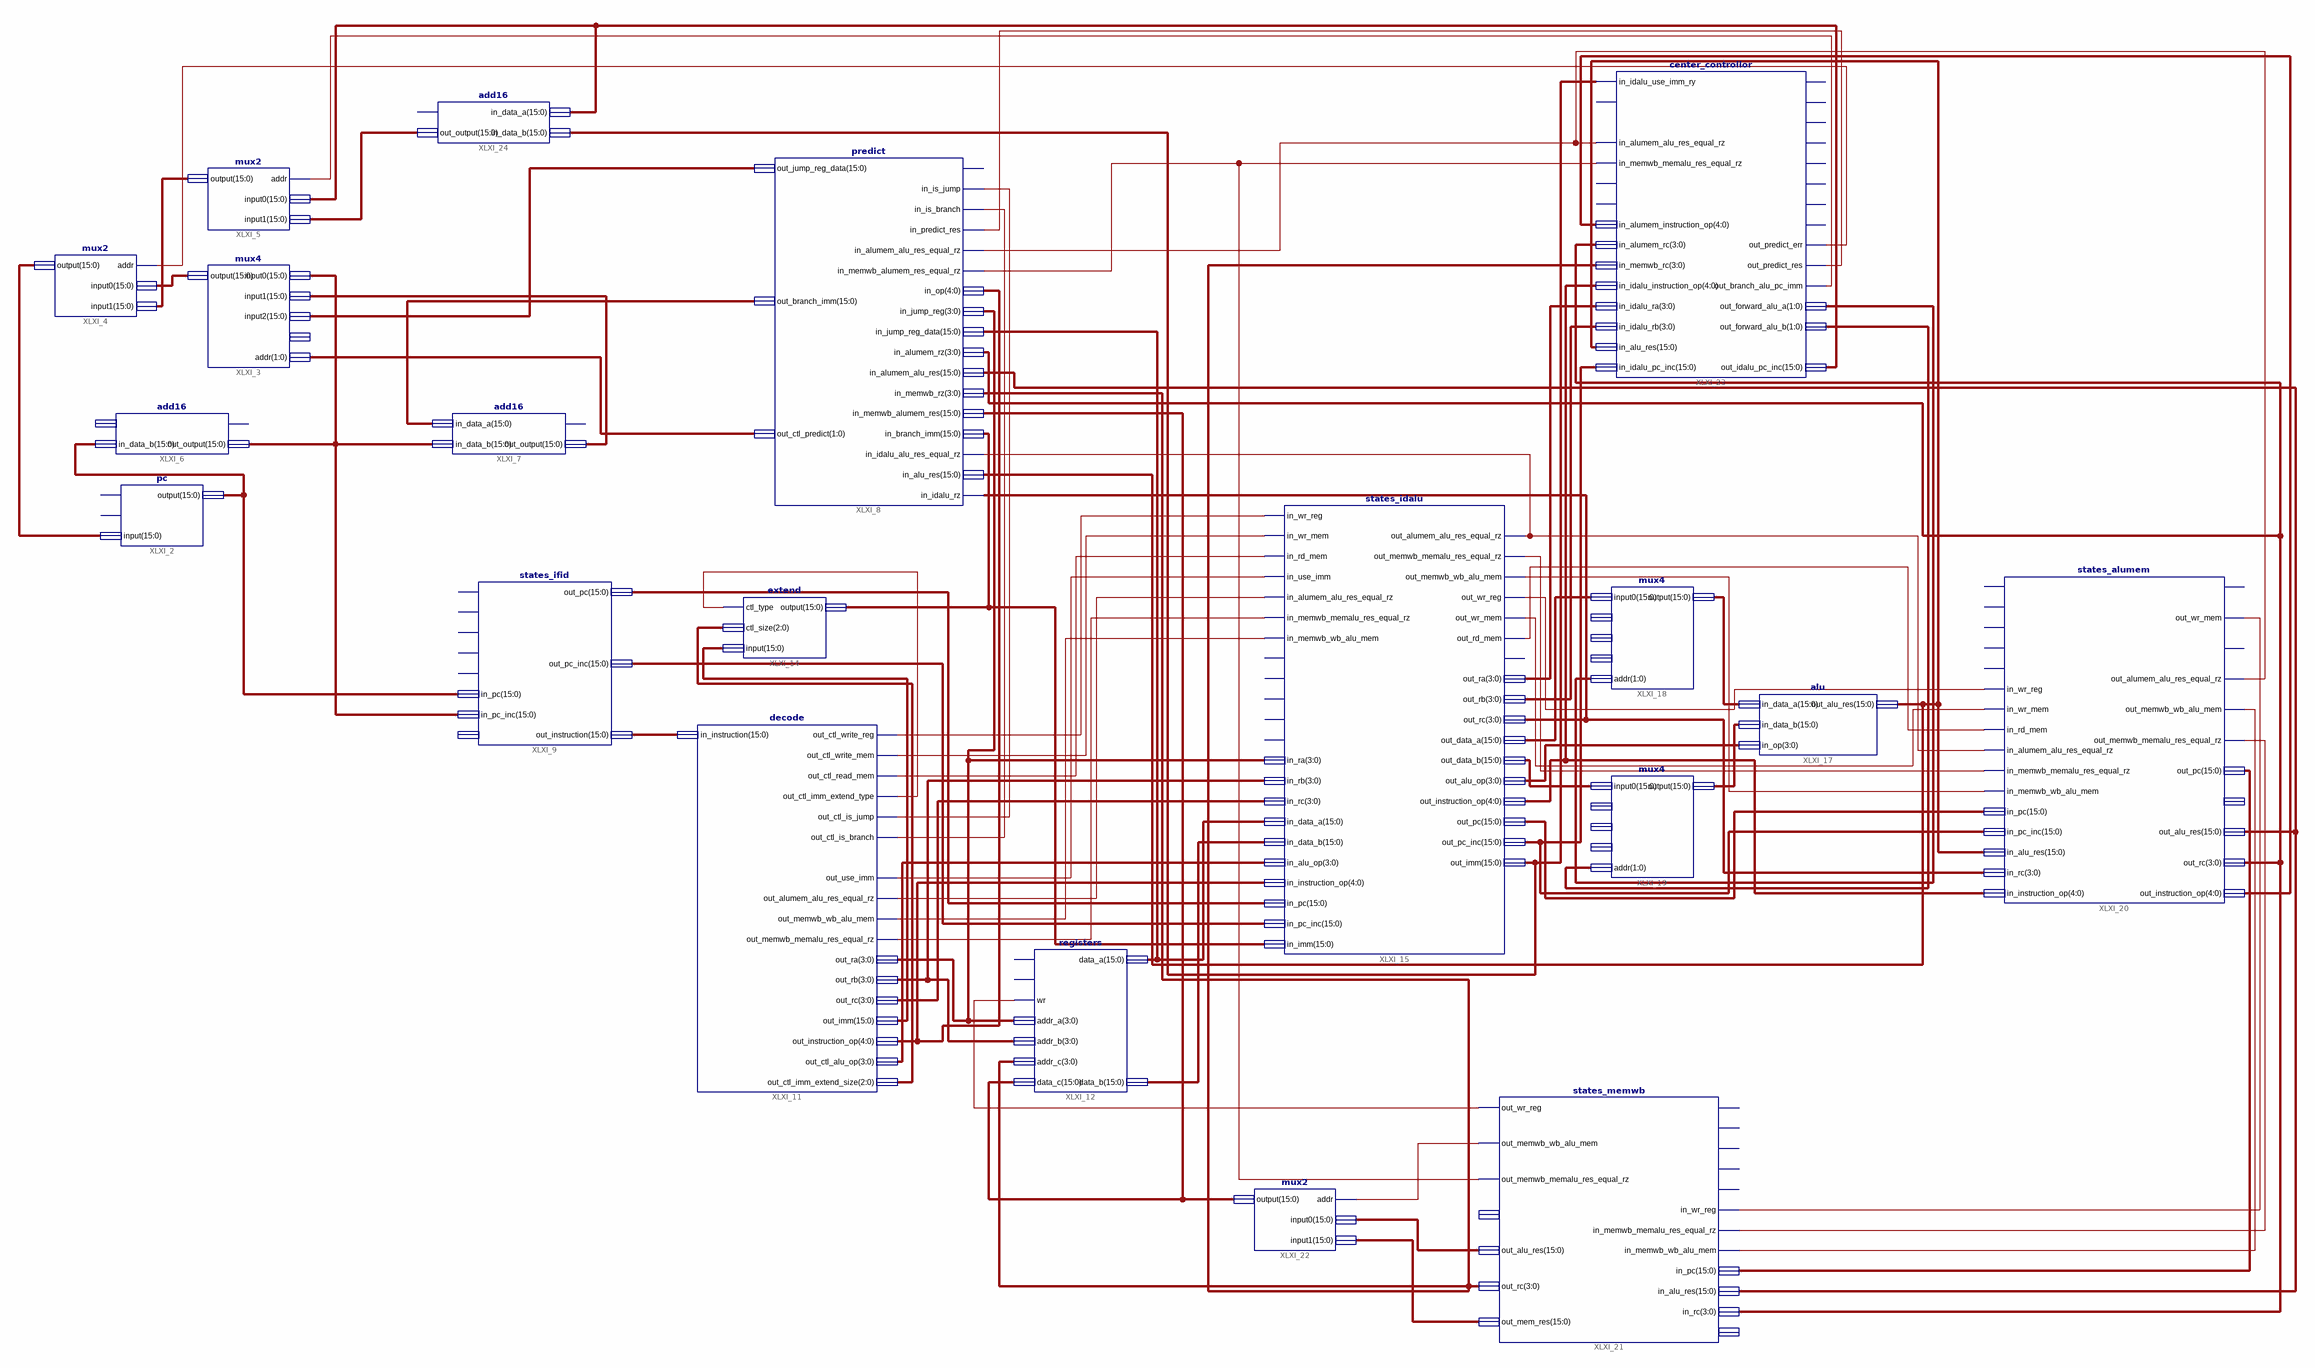
[diagram p0: schematic sheet 1]
// Xilinx ISE schematic cpu.sch (spartan3e) as structural Verilog: 20 symbols, 0 ports
module cpu (
);

  wire XLXN_22, XLXN_33, XLXN_34, XLXN_35, XLXN_36, XLXN_37, XLXN_38, XLXN_39, XLXN_40, XLXN_41, XLXN_53,
       XLXN_54, XLXN_55, XLXN_56, XLXN_57, XLXN_58, XLXN_59, XLXN_61, XLXN_62, XLXN_66, XLXN_69, XLXN_82,
       XLXN_83, XLXN_88, XLXN_90, XLXN_91;
  wire [1:0] XLXN_5, XLXN_84, XLXN_85;
  wire [2:0] XLXN_23;
  wire [3:0] XLXN_17, XLXN_27, XLXN_32, XLXN_45, XLXN_51, XLXN_64, XLXN_67, XLXN_79, XLXN_80, XLXN_95;
  wire [4:0] XLXN_26, XLXN_52, XLXN_76;
  wire [15:0] XLXN_3, XLXN_4, XLXN_7, XLXN_8, XLXN_9, XLXN_12, XLXN_13, XLXN_14, XLXN_15, XLXN_18, XLXN_21,
       XLXN_24, XLXN_25, XLXN_28, XLXN_29, XLXN_43, XLXN_44, XLXN_46, XLXN_47, XLXN_48, XLXN_49, XLXN_50,
       XLXN_63, XLXN_65, XLXN_70, XLXN_71, XLXN_72, XLXN_73, XLXN_86, XLXN_87;

  pc XLXI_2 (.\input (XLXN_12), .\output (XLXN_13));  // open: clk, wr
  mux4 XLXI_3 (.input0(XLXN_14), .input1(XLXN_3), .input2(XLXN_7), .addr(XLXN_5), .\output (XLXN_8));  // open: input3
  mux2 XLXI_4 (.addr(XLXN_82), .input0(XLXN_8), .input1(XLXN_9), .\output (XLXN_12));
  mux2 XLXI_5 (.addr(XLXN_88), .input0(XLXN_86), .input1(XLXN_87), .\output (XLXN_9));
  add16 XLXI_6 (.in_data_b(XLXN_13), .out_output(XLXN_14));  // open: in_data_a, out_t
  add16 XLXI_7 (.in_data_a(XLXN_4), .in_data_b(XLXN_14), .out_output(XLXN_3));  // open: out_t
  predict XLXI_8 (
    .in_is_jump(XLXN_40), .in_is_branch(XLXN_41), .in_predict_res(XLXN_83),
    .in_idalu_alu_res_equal_rz(XLXN_55), .in_idalu_rz(XLXN_51), .in_alumem_alu_res_equal_rz(XLXN_90),
    .in_memwb_alumem_res_equal_rz(XLXN_91), .in_op(XLXN_26), .in_jump_reg(XLXN_95),
    .in_jump_reg_data(XLXN_28), .in_alu_res(XLXN_48), .in_alumem_rz(XLXN_64), .in_alumem_alu_res(XLXN_65),
    .in_memwb_rz(XLXN_67), .in_memwb_alumem_res(XLXN_72), .in_branch_imm(XLXN_25),
    .out_jump_reg_data(XLXN_7), .out_branch_imm(XLXN_4), .out_ctl_predict(XLXN_5));  // open: rst
  states_ifid XLXI_9 (
    .in_pc(XLXN_13), .in_pc_inc(XLXN_14), .out_pc(XLXN_18), .out_pc_inc(XLXN_21), .out_instruction(XLXN_15));  // open: clk, rst, ctl_bubble, ctl_copy, ctl_rst, in_instruction
  decode XLXI_11 (
    .in_instruction(XLXN_15), .out_ctl_write_reg(XLXN_33), .out_ctl_write_mem(XLXN_34),
    .out_ctl_read_mem(XLXN_35), .out_ctl_imm_extend_type(XLXN_22), .out_ctl_is_jump(XLXN_40),
    .out_ctl_is_branch(XLXN_41), .out_use_imm(XLXN_36), .out_alumem_alu_res_equal_rz(XLXN_39),
    .out_memwb_wb_alu_mem(XLXN_37), .out_memwb_memalu_res_equal_rz(XLXN_38), .out_ra(XLXN_95),
    .out_rb(XLXN_17), .out_rc(XLXN_32), .out_imm(XLXN_24), .out_instruction_op(XLXN_26),
    .out_ctl_alu_op(XLXN_27), .out_ctl_imm_extend_size(XLXN_23));
  registers XLXI_12 (
    .wr(XLXN_66), .addr_a(XLXN_95), .addr_b(XLXN_17), .addr_c(XLXN_67), .data_c(XLXN_72), .data_a(XLXN_28),
    .data_b(XLXN_29));  // open: clk, rst
  extend XLXI_14 (.ctl_type(XLXN_22), .ctl_size(XLXN_23), .\input (XLXN_24), .\output (XLXN_25));
  states_idalu XLXI_15 (
    .in_wr_reg(XLXN_33), .in_wr_mem(XLXN_34), .in_rd_mem(XLXN_35), .in_use_imm(XLXN_36),
    .in_alumem_alu_res_equal_rz(XLXN_39), .in_memwb_memalu_res_equal_rz(XLXN_38),
    .in_memwb_wb_alu_mem(XLXN_37), .in_ra(XLXN_95), .in_rb(XLXN_17), .in_rc(XLXN_32), .in_data_a(XLXN_28),
    .in_data_b(XLXN_29), .in_alu_op(XLXN_27), .in_instruction_op(XLXN_26), .in_pc(XLXN_18),
    .in_pc_inc(XLXN_21), .in_imm(XLXN_25), .out_alumem_alu_res_equal_rz(XLXN_55),
    .out_memwb_memalu_res_equal_rz(XLXN_54), .out_memwb_wb_alu_mem(XLXN_53), .out_wr_reg(XLXN_56),
    .out_wr_mem(XLXN_57), .out_rd_mem(XLXN_58), .out_ra(XLXN_79), .out_rb(XLXN_80), .out_rc(XLXN_51),
    .out_data_a(XLXN_43), .out_data_b(XLXN_44), .out_alu_op(XLXN_45), .out_instruction_op(XLXN_52),
    .out_pc(XLXN_49), .out_pc_inc(XLXN_50), .out_imm(XLXN_73));  // open: ctl_bubble, ctl_copy, ctl_rst, clk, rst, out_use_imm
  alu XLXI_17 (.in_data_a(XLXN_46), .in_data_b(XLXN_47), .in_op(XLXN_45), .out_alu_res(XLXN_48));
  mux4 XLXI_18 (.input0(XLXN_43), .addr(XLXN_84), .\output (XLXN_46));  // open: input1, input2, input3
  mux4 XLXI_19 (.input0(XLXN_44), .addr(XLXN_85), .\output (XLXN_47));  // open: input1, input2, input3
  states_alumem XLXI_20 (
    .in_wr_reg(XLXN_56), .in_wr_mem(XLXN_57), .in_rd_mem(XLXN_58), .in_alumem_alu_res_equal_rz(XLXN_55),
    .in_memwb_memalu_res_equal_rz(XLXN_54), .in_memwb_wb_alu_mem(XLXN_53), .in_pc(XLXN_49),
    .in_pc_inc(XLXN_50), .in_alu_res(XLXN_48), .in_rc(XLXN_51), .in_instruction_op(XLXN_52),
    .out_wr_mem(XLXN_59), .out_alumem_alu_res_equal_rz(XLXN_90), .out_memwb_wb_alu_mem(XLXN_61),
    .out_memwb_memalu_res_equal_rz(XLXN_62), .out_pc(XLXN_63), .out_alu_res(XLXN_65), .out_rc(XLXN_64),
    .out_instruction_op(XLXN_76));  // open: clk, rst, ctl_bubble, ctl_copy, ctl_rst, out_wr_reg, out_rd_mem, out_pc_inc
  states_memwb XLXI_21 (
    .in_wr_reg(XLXN_59), .in_memwb_memalu_res_equal_rz(XLXN_62), .in_memwb_wb_alu_mem(XLXN_61),
    .in_pc(XLXN_63), .in_alu_res(XLXN_65), .in_rc(XLXN_64), .out_wr_reg(XLXN_66),
    .out_memwb_wb_alu_mem(XLXN_69), .out_memwb_memalu_res_equal_rz(XLXN_91), .out_alu_res(XLXN_70),
    .out_rc(XLXN_67), .out_mem_res(XLXN_71));  // open: clk, rst, ctl_bubble, ctl_copy, ctl_rst, in_mem_res, out_pc
  mux2 XLXI_22 (.addr(XLXN_69), .input0(XLXN_70), .input1(XLXN_71), .\output (XLXN_72));
  center_controllor XLXI_23 (
    .in_idalu_use_imm_ry(XLXN_73), .in_alumem_alu_res_equal_rz(XLXN_90),
    .in_memwb_memalu_res_equal_rz(XLXN_91), .in_alumem_instruction_op(XLXN_76), .in_alumem_rc(XLXN_64),
    .in_memwb_rc(XLXN_67), .in_idalu_instruction_op(XLXN_52), .in_idalu_ra(XLXN_79), .in_idalu_rb(XLXN_80),
    .in_alu_res(XLXN_48), .in_idalu_pc_inc(XLXN_50), .out_predict_err(XLXN_82), .out_predict_res(XLXN_83),
    .out_branch_alu_pc_imm(XLXN_88), .out_forward_alu_a(XLXN_84), .out_forward_alu_b(XLXN_85),
    .out_idalu_pc_inc(XLXN_86));  // open: in_key_interrupt, clk, rst, out_bubble_ifid, out_bubble_idalu, out_bubble_alumem, out_bubble_memwb, out_rst_ifid, out_rst_idalu, out_rst_alumem, out_rst_memwb
  add16 XLXI_24 (.in_data_a(XLXN_86), .in_data_b(XLXN_73), .out_output(XLXN_87));  // open: out_t
endmodule
